# Altium schematic sheet main3425.SchDoc
size A4; SheetNumber: 4; SheetTotal: 4
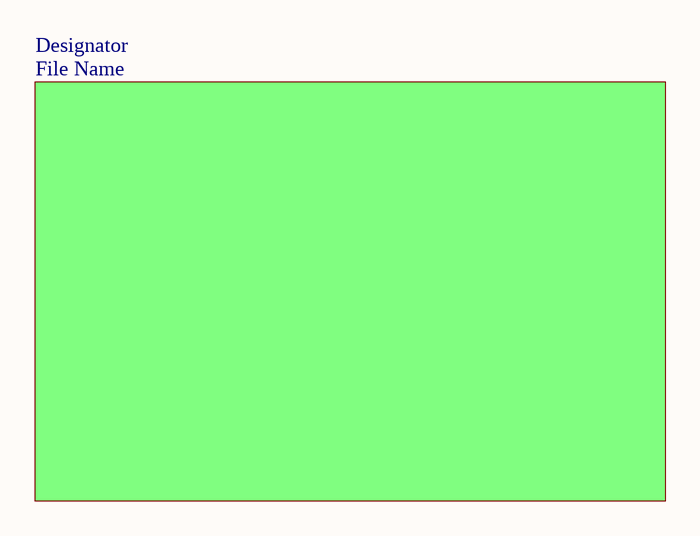
[diagram p0: main3425.SchDoc]

## Sub-sheets
Designator = File Name: no entries